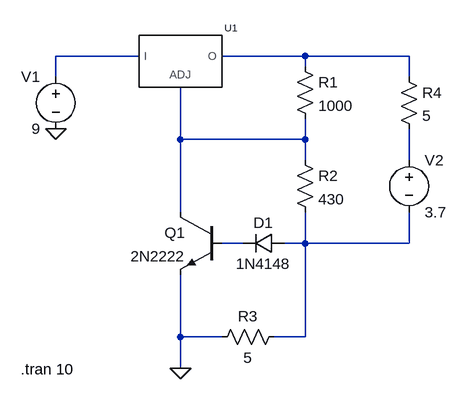
[diagram p0: schematic power_supply.asc]
power_supply.asc, the LTspice schematic file:
Version 4
SHEET 1 880 680
WIRE 64 112 -64 112
WIRE 320 112 192 112
WIRE 480 112 320 112
WIRE 320 128 320 112
WIRE -64 144 -64 112
WIRE 480 144 480 112
WIRE 128 240 128 160
WIRE 320 240 320 208
WIRE 320 240 128 240
WIRE 320 272 320 240
WIRE 480 272 480 224
WIRE 128 352 128 240
WIRE 224 400 192 400
WIRE 320 400 320 352
WIRE 320 400 288 400
WIRE 480 400 480 352
WIRE 480 400 320 400
WIRE 128 544 128 448
WIRE 192 544 128 544
WIRE 320 544 320 400
WIRE 320 544 272 544
WIRE 128 592 128 544
FLAG -64 224 0
FLAG 128 592 0
SYMBOL lm317 128 112 R0
SYMATTR InstName U1
SYMBOL voltage -64 128 M0
SYMATTR InstName V1
SYMATTR Value 9
SYMBOL res 304 112 R0
SYMATTR InstName R1
SYMATTR Value 1000
SYMBOL res 304 256 R0
SYMATTR InstName R2
SYMATTR Value 430
SYMBOL npn 192 352 M0
SYMATTR InstName Q1
SYMATTR Value 2N2222
SYMBOL diode 288 384 R90
WINDOW 0 0 32 VBottom 2
WINDOW 3 32 32 VTop 2
SYMATTR InstName D1
SYMATTR Value 1N4148
SYMBOL res 288 528 R90
WINDOW 0 0 56 VBottom 2
WINDOW 3 32 56 VTop 2
SYMATTR InstName R3
SYMATTR Value 5
SYMBOL res 464 128 R0
SYMATTR InstName R4
SYMATTR Value 5
SYMBOL voltage 480 256 R0
SYMATTR InstName V2
SYMATTR Value 3.7
TEXT -118 594 Left 2 !.tran 10

The netlist it stands for:
* power_supply.asc
XU1 N001 N003 N002 LM317 LM317  ; pins I ADJ O
V1 N001 0 9
R1 N002 N003 1000
R2 N003 N006 430
Q1 N003 N005 0 0 2N2222
D1 N006 N005 1N4148
R3 N006 0 5
R4 N002 N004 5
V2 N004 N006 3.7
.model D D
.lib standard.dio
.model NPN NPN
.model PNP PNP
.lib standard.bjt
.tran 10
.lib LM317.sub
.backanno
.end